# EasyEDA Pro project PCBPhase.eprj

# Schematic PCBPhase
Create Date: 2024-09-20; Page Name: P1; Project Name: PCBPhase; Schematic Name: PCBPhase; Update Date: 2024-09-19; Company: EasyEDA.com; Drawn: EasyEDA; Page Size: A4; Part Number: JLCPCB-002; Reviewed: EasyEDA; Version: V0.1
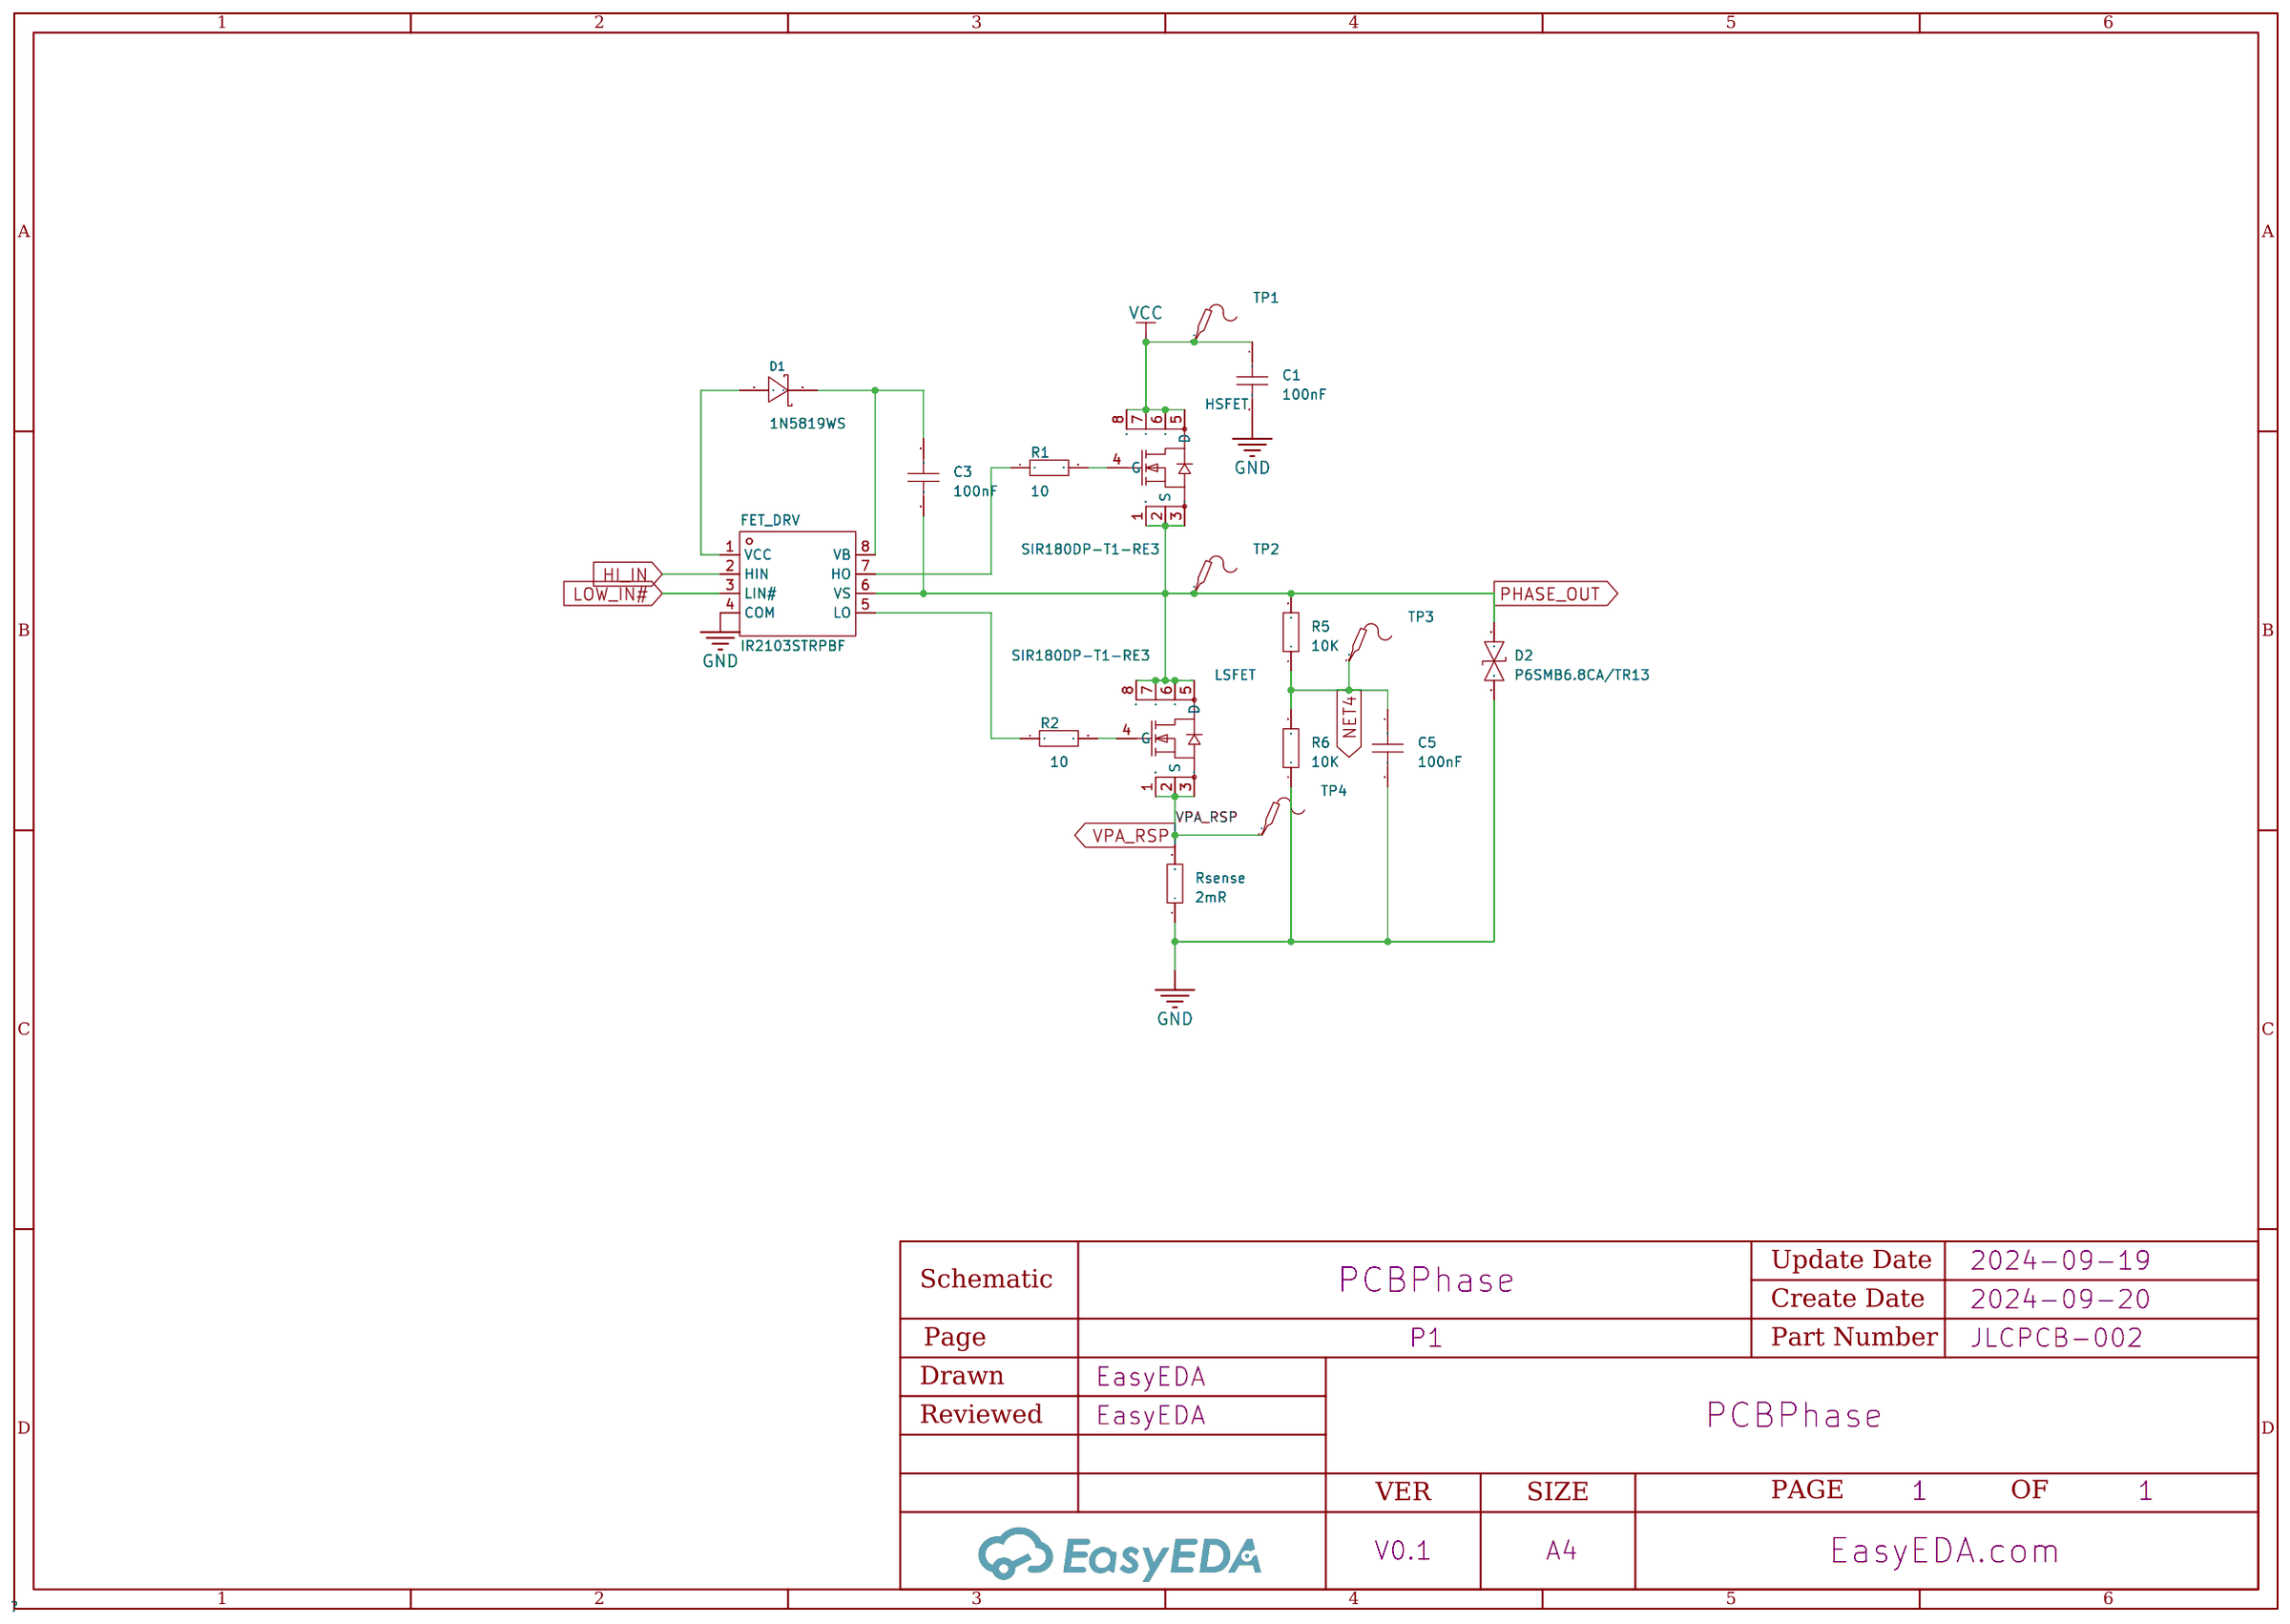
[diagram p0: schematic sheet]

## Parts
C1  100nF  [C0603]
C3  100nF  [C0603]
C5  100nF  [C0603]
D1  1N5819WS  [SOD-323_L1.8-W1.3-LS2.5-RD]
D2  P6SMB6.8CA/TR13  [SMB_L4.6-W3.6-LS5.3-BI]
FET_DRV  IR2103STRPBF  [SOIC-8_L4.9-W3.9-P1.27-LS6.0-BL]
HSFET  SIR180DP-T1-RE3  [POWERPAK-SO-8_L5.9-W4.9-P1.27-LS6.2-BL]
LSFET  SIR180DP-T1-RE3  [POWERPAK-SO-8_L5.9-W4.9-P1.27-LS6.2-BL]
R1  10  [R0603]
R2  10  [R0603]
R5  10K  [R0603]
R6  10K  [R0603]
Rsense  2mR  [R0603]
TP1  -  [Test-Point-0.5mm]
TP2  -  [Test-Point-0.5mm]
TP3  -  [Test-Point-0.5mm]
TP4  -  [Test-Point-0.5mm]

## Library data of the parts
C1 C3 C5 = CAP_0603: Supplier Footprint: 0603
D1 = 1N5819WS_C191023: Forward Voltage (Vf@If):600mV@1A Reverse Voltage (Vr):40V Average Rectified Current (Io):1A; LCSC Part Name: 电压:40V 电流:1A; Supplier Part: C191023; Manufacturer: Hottech(合科泰); Supplier Footprint: SOD-323; JLCPCB Part Class: Basic Part; Datasheet: https://atta.szlcsc.com/upload/public/pdf/source/20220428/3CB86FD8D28D653594B4E35F9D5AEFD9.pdf; Supplier: LCSC; Forward Voltage (Vf@If): 600mV@1A; Reverse Voltage (Vr): 40V; Average Rectified Current (Io): 1A
D2 = P6SMB6.8CA/TR13: Reverse Stand-Off Voltage (Vrwm):5.8V Maximum Clamping Voltage:10.5V Peak Pulse Current (Ipp)@10/1000us:58.1A Peak Pulse Power Dissipation (Ppp)@10/1000us:600W Breakdown Voltage:6.45V Type:TVS; Supplier Part: C78395; Manufacturer: Brightking(君耀电子); Supplier Footprint: SMB(DO-214AA); JLCPCB Part Class: Basic Part; Datasheet: https://atta.szlcsc.com/upload/public/pdf/source/20160709/1468031879762.pdf; Supplier: LCSC; Reverse Stand-Off Voltage (Vrwm): 5.8V; Maximum Clamping Voltage: 10.5V; Peak Pulse Current (Ipp)@10/1000us: 58.1A; Peak Pulse Power Dissipation (Ppp)@10/1000us: 600W; Breakdown Voltage: 6.45V; Type: TVS
FET_DRV = IR2103STRPBF: Driven Configuration:Half Bridge Load Type:MOSFET；IGBT Number of Drivers:2 Peak Output Current(sink):360mA Peak Output Current(source):210mA Supply Voltage:10V~20V Supply Voltage:10V~20V Rise Time:100ns Fall Time:50ns Operating Temperature:-40℃~+150℃@(Tj); Supplier Part: C2957; Manufacturer: Infineon(英飞凌); Supplier Footprint: SOIC-8; JLCPCB Part Class: Extended Part; Datasheet: https://atta.szlcsc.com/upload/public/pdf/source/20140228/1457706997637.pdf; Supplier: LCSC; Driven Configuration: Half Bridge; Load Type: MOSFET；IGBT; Number of Drivers: 2; Peak Output Current(sink): 360mA; Peak Output Current(source): 210mA; Supply Voltage: 10V~20V; Rise Time: 100ns; Fall Time: 50ns; Operating Temperature: -40℃~+150℃@(Tj)
HSFET LSFET = SIR180DP-T1-RE3: Type:1个NChannel Drain Source Voltage (Vdss):60V Continuous Drain Current (Id):；32.4A Power Dissipation (Pd):； Drain Source On Resistance (RDS(on)@Vgs,Id):2.05mΩ@10A,10V Gate Threshold Voltage (Vgs(th)@Id):3.6V@250uA Total Gate Charge (Qg@Vgs):87nC@10V Inp; LCSC Part Name: 1个N沟道 耐压:60V 电流:60A 电流:32.4A; Supplier Part: C5334421; Manufacturer: VISHAY(威世); Supplier Footprint: SO-8; JLCPCB Part Class: Extended Part; Datasheet: https://atta.szlcsc.com/upload/public/pdf/source/20221230/5EAF42ED79532020A551540FC13481A3.pdf; Supplier: LCSC; Type: 1个NChannel; Drain Source Voltage (Vdss): 60V; Continuous Drain Current (Id): ；32.4A; Power Dissipation (Pd): ；; Drain Source On Resistance (RDS(on)@Vgs,Id): 2.05mΩ@10A,10V; Gate Threshold Voltage (Vgs(th)@Id): 3.6V@250uA; Total Gate Charge (Qg@Vgs): 87nC@10V; Input Capacitance (Ciss@Vds): 4.03nF@30V; Operating Temperature: -55℃~+150℃@(Tj)
R1 R2 R5 R6 Rsense = Res_0603: Supplier Footprint: 0603
TP1-TP4 = Test-Point: Test Point 测试点

## Nets
GND: C1.2 C5.2 D2.1 FET_DRV.4(COM) R6.1 Rsense.1
VCC: C1.1 HSFET.5(D) HSFET.6(D) HSFET.7(D) HSFET.8(D) TP1.1
HI_IN: FET_DRV.2(HIN)
LOW_IN#: FET_DRV.3(LIN#)
NET4: C5.1 R5.1 R6.2 TP3.1
PHASE_OUT: C3.2 D2.2 FET_DRV.6(VS) HSFET.1(S) HSFET.2(S) HSFET.3(S) LSFET.5(D) LSFET.6(D) LSFET.7(D) LSFET.8(D) R5.2 TP2.1
VPA_RSP: LSFET.1(S) LSFET.2(S) LSFET.3(S) Rsense.2 TP4.1
$1N508: FET_DRV.7(HO) R1.1
$1N509: HSFET.4(G) R1.2
$1N510: FET_DRV.5(LO) R2.1
$1N511: LSFET.4(G) R2.2
$1N519: D1.2(A) FET_DRV.1(VCC)
$1N521: C3.1 D1.1(K) FET_DRV.8(VB)

# Schematic Schematic1
Create Date: 2024-09-20; Page Name: P1; Project Name: PCBPhase; Schematic Name: Schematic1; Update Date: 2024-09-20; Company: EasyEDA.com; Drawn: EasyEDA; Page Size: A4; Part Number: JLCPCB-002; Reviewed: EasyEDA; Version: V0.1
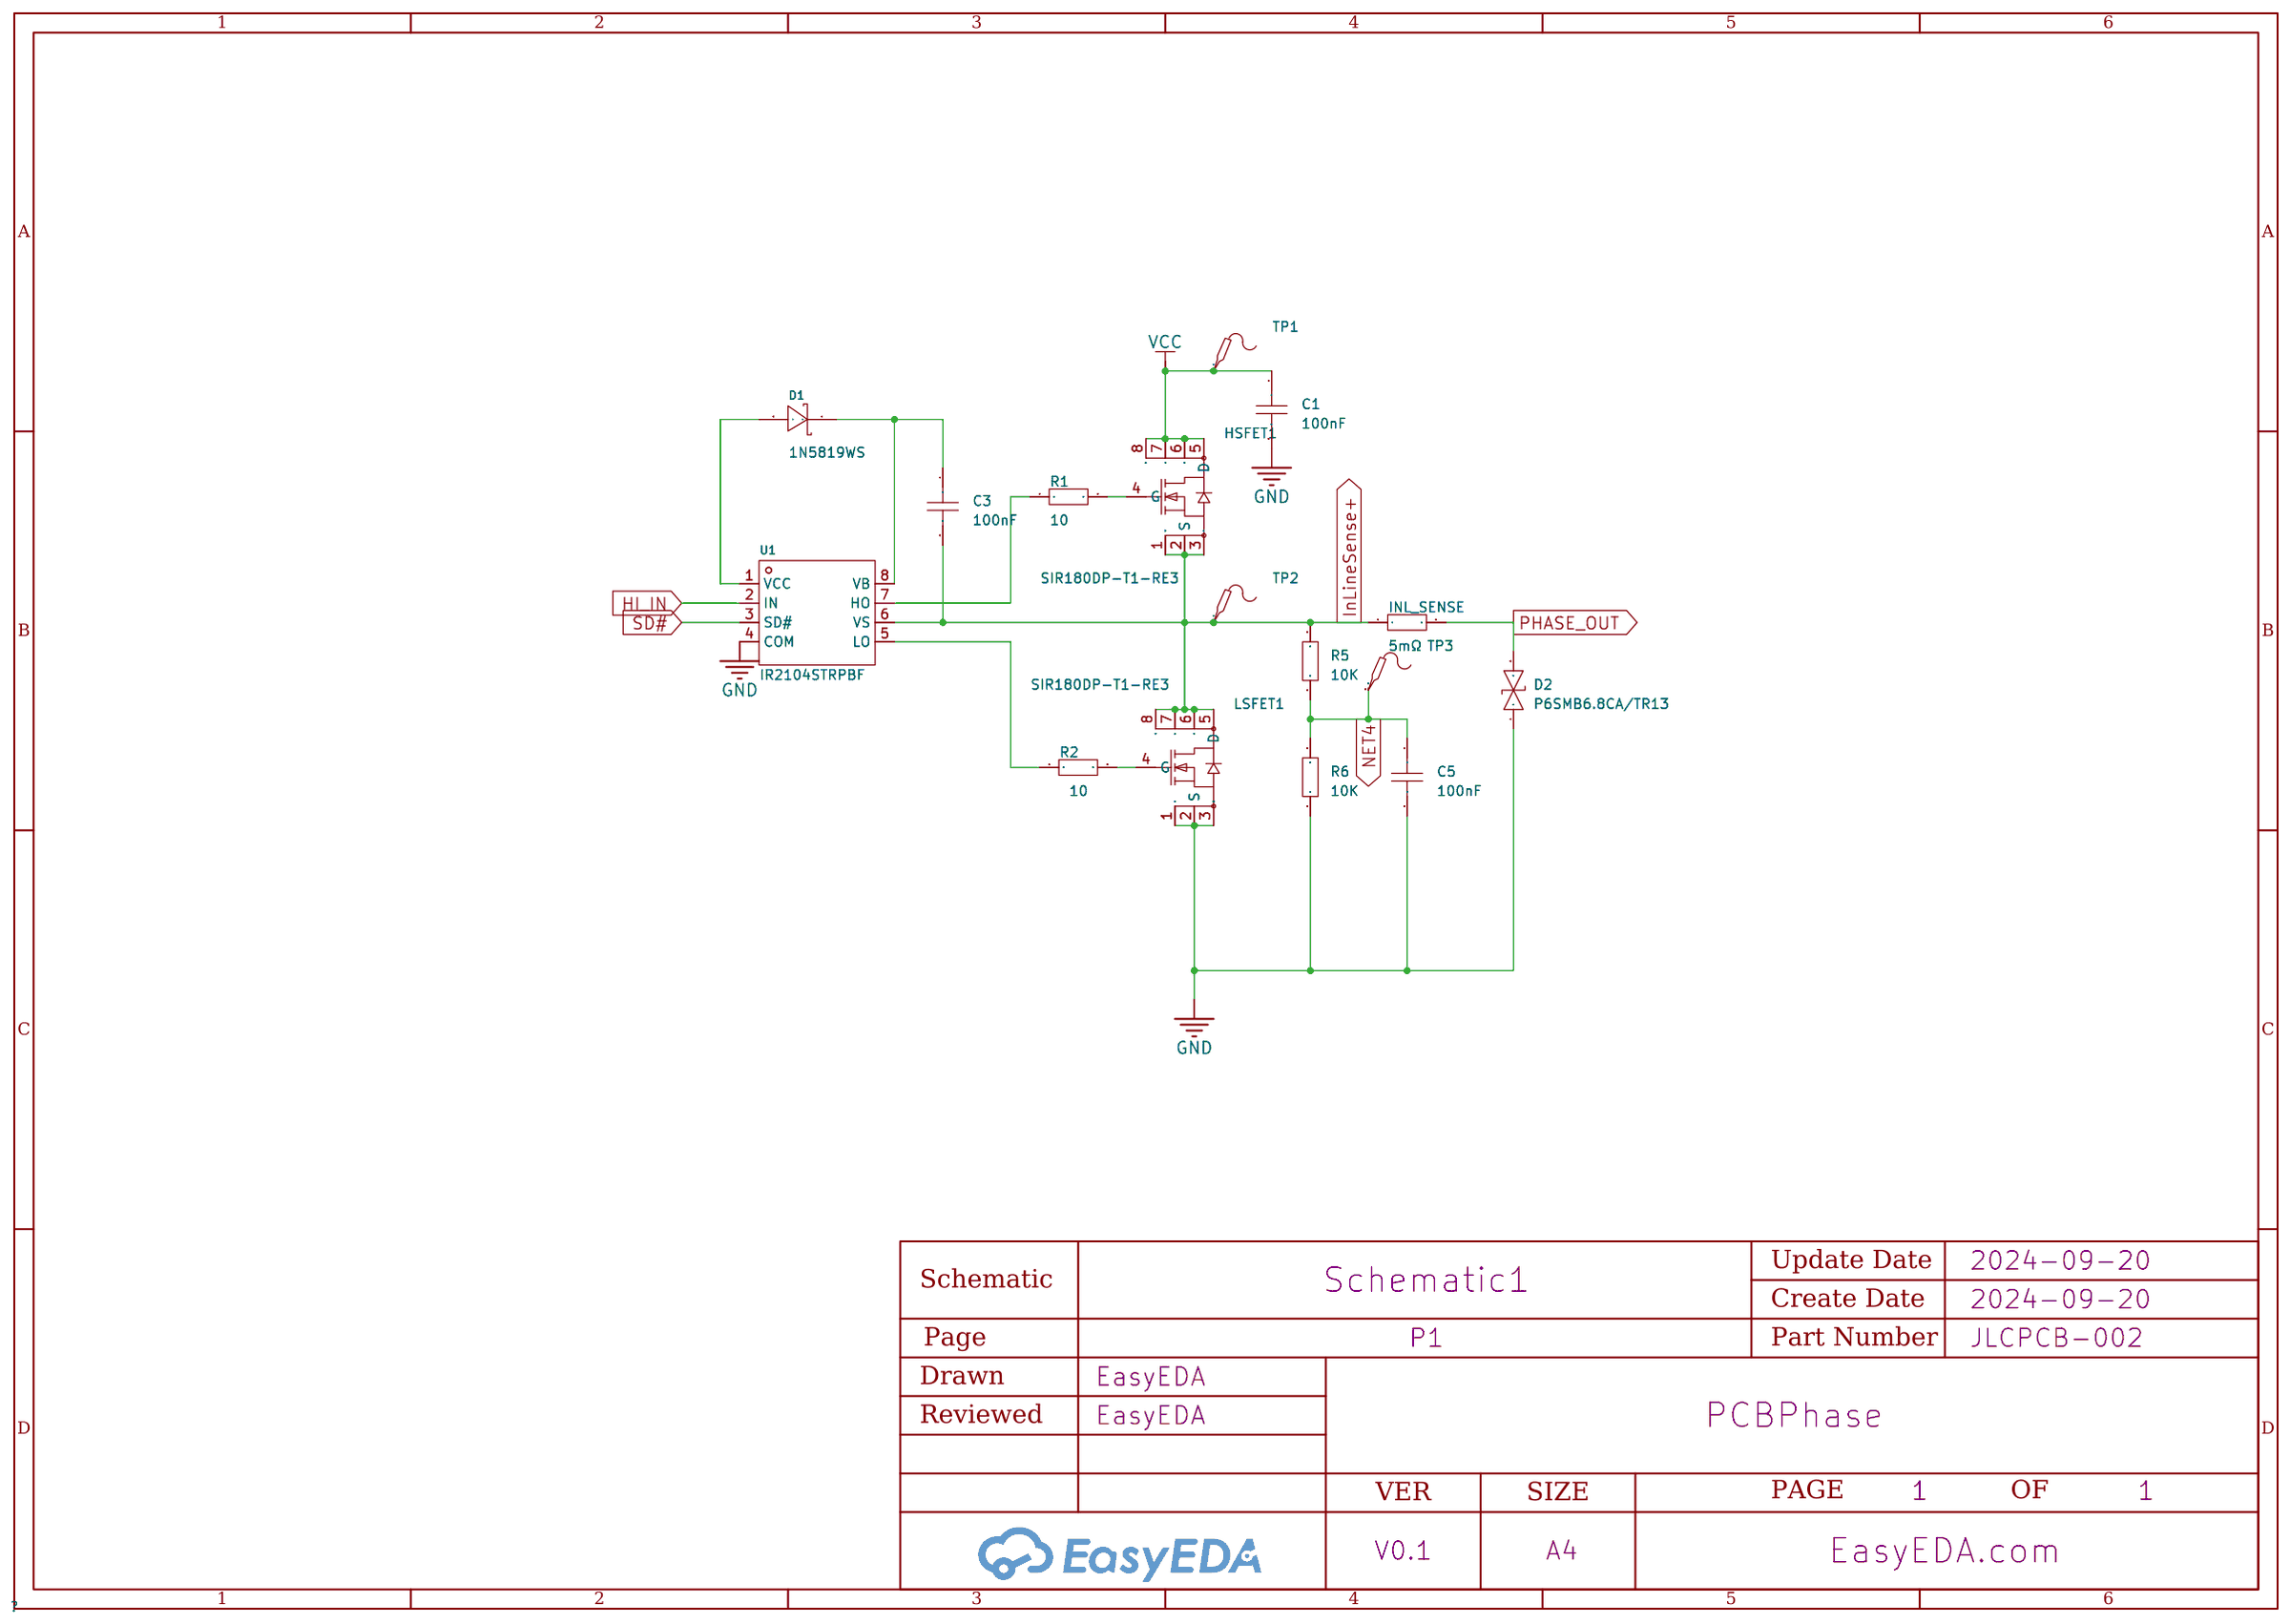
[diagram p1: schematic sheet]

## Parts
C1  100nF  [C0603]
C3  100nF  [C0603]
C5  100nF  [C0603]
D1  1N5819WS  [SOD-323_L1.8-W1.3-LS2.5-RD]
D2  P6SMB6.8CA/TR13  [SMB_L4.6-W3.6-LS5.3-BI]
HSFET1  SIR180DP-T1-RE3  [POWERPAK-SO-8_L5.9-W4.9-P1.27-LS6.2-BL]
INL_SENSE  5mΩ  [R2512]
LSFET1  SIR180DP-T1-RE3  [POWERPAK-SO-8_L5.9-W4.9-P1.27-LS6.2-BL]
R1  10  [R0603]
R2  10  [R0603]
R5  10K  [R0603]
R6  10K  [R0603]
TP1  -  [Test-Point-0.5mm]
TP2  -  [Test-Point-0.5mm]
TP3  -  [Test-Point-0.5mm]
U1  IR2104STRPBF  [SOIC-8_L4.9-W3.9-P1.27-LS6.0-BL]

## Library data of the parts
C1 C3 C5 = CAP_0603: Supplier Footprint: 0603
D1 = 1N5819WS_C191023: Forward Voltage (Vf@If):600mV@1A Reverse Voltage (Vr):40V Average Rectified Current (Io):1A; LCSC Part Name: 电压:40V 电流:1A; Supplier Part: C191023; Manufacturer: Hottech(合科泰); Supplier Footprint: SOD-323; JLCPCB Part Class: Basic Part; Datasheet: https://atta.szlcsc.com/upload/public/pdf/source/20220428/3CB86FD8D28D653594B4E35F9D5AEFD9.pdf; Supplier: LCSC; Forward Voltage (Vf@If): 600mV@1A; Reverse Voltage (Vr): 40V; Average Rectified Current (Io): 1A
D2 = P6SMB6.8CA/TR13: Reverse Stand-Off Voltage (Vrwm):5.8V Maximum Clamping Voltage:10.5V Peak Pulse Current (Ipp)@10/1000us:58.1A Peak Pulse Power Dissipation (Ppp)@10/1000us:600W Breakdown Voltage:6.45V Type:TVS; Supplier Part: C78395; Manufacturer: Brightking(君耀电子); Supplier Footprint: SMB(DO-214AA); JLCPCB Part Class: Basic Part; Datasheet: https://atta.szlcsc.com/upload/public/pdf/source/20160709/1468031879762.pdf; Supplier: LCSC; Reverse Stand-Off Voltage (Vrwm): 5.8V; Maximum Clamping Voltage: 10.5V; Peak Pulse Current (Ipp)@10/1000us: 58.1A; Peak Pulse Power Dissipation (Ppp)@10/1000us: 600W; Breakdown Voltage: 6.45V; Type: TVS
HSFET1 LSFET1 = SIR180DP-T1-RE3: Type:1个NChannel Drain Source Voltage (Vdss):60V Continuous Drain Current (Id):；32.4A Power Dissipation (Pd):； Drain Source On Resistance (RDS(on)@Vgs,Id):2.05mΩ@10A,10V Gate Threshold Voltage (Vgs(th)@Id):3.6V@250uA Total Gate Charge (Qg@Vgs):87nC@10V Inp; LCSC Part Name: 1个N沟道 耐压:60V 电流:60A 电流:32.4A; Supplier Part: C5334421; Manufacturer: VISHAY(威世); Supplier Footprint: SO-8; JLCPCB Part Class: Extended Part; Datasheet: https://atta.szlcsc.com/upload/public/pdf/source/20221230/5EAF42ED79532020A551540FC13481A3.pdf; Supplier: LCSC; Type: 1个NChannel; Drain Source Voltage (Vdss): 60V; Continuous Drain Current (Id): ；32.4A; Power Dissipation (Pd): ；; Drain Source On Resistance (RDS(on)@Vgs,Id): 2.05mΩ@10A,10V; Gate Threshold Voltage (Vgs(th)@Id): 3.6V@250uA; Total Gate Charge (Qg@Vgs): 87nC@10V; Input Capacitance (Ciss@Vds): 4.03nF@30V; Operating Temperature: -55℃~+150℃@(Tj)
INL_SENSE = PA2512FKF7W0R005E: Type:Current Sensing Resistors Resistance: Tolerance:±1% Tolerance:±1% Power(Watts): Temperature Coefficient:±100ppm/℃ Temperature Coefficient:±100ppm/℃; LCSC Part Name: 5mΩ ±1% 2W; Supplier Part: C309526; Manufacturer: YAGEO(国巨); Supplier Footprint: 2512; JLCPCB Part Class: Extended Part; Datasheet: https://atta.szlcsc.com/upload/public/pdf/source/20190227/C375693_219964CC8B3EBD36DBDF701587FA5938.pdf; Supplier: LCSC; Type: Current Sensing Resistors; Tolerance: ±1%; Temperature Coefficient: ±100ppm/℃
R1 R2 R5 R6 = Res_0603: Supplier Footprint: 0603
TP1-TP3 = Test-Point: Test Point 测试点
U1 = IR2104STRPBF: Driven Configuration:Half Bridge Load Type:MOSFET；IGBT Number of Drivers:2 Peak Output Current(sink):360mA Peak Output Current(source):210mA Supply Voltage:10V~20V Supply Voltage:10V~20V Rise Time:100ns Fall Time:50ns Operating Temperature:-40℃~+150℃@(Tj); Supplier Part: C2960; Manufacturer: Infineon(英飞凌); Supplier Footprint: SOIC-8; JLCPCB Part Class: Extended Part; Datasheet: https://atta.szlcsc.com/upload/public/pdf/source/20140906/1457707236579.pdf; Supplier: LCSC; Driven Configuration: Half Bridge; Load Type: MOSFET；IGBT; Number of Drivers: 2; Peak Output Current(sink): 360mA; Peak Output Current(source): 210mA; Supply Voltage: 10V~20V; Rise Time: 100ns; Fall Time: 50ns; Operating Temperature: -40℃~+150℃@(Tj)

## Nets
GND: C1.2 C5.2 D2.1 LSFET1.1(S) LSFET1.2(S) LSFET1.3(S) R6.1 U1.4(COM)
VCC: C1.1 HSFET1.5(D) HSFET1.6(D) HSFET1.7(D) HSFET1.8(D) TP1.1
HI_IN: U1.2(IN)
InLineSense+: C3.2 HSFET1.1(S) HSFET1.2(S) HSFET1.3(S) INL_SENSE.1 LSFET1.5(D) LSFET1.6(D) LSFET1.7(D) LSFET1.8(D) R5.2 TP2.1 U1.6(VS)
NET4: C5.1 R5.1 R6.2 TP3.1
PHASE_OUT: D2.2 INL_SENSE.2
SD#: U1.3(SD#)
$1N624: R1.1 U1.7(HO)
$1N625: HSFET1.4(G) R1.2
$1N626: R2.1 U1.5(LO)
$1N627: LSFET1.4(G) R2.2
$1N633: D1.2(A) U1.1(VCC)
$1N635: C3.1 D1.1(K) U1.8(VB)

# Board PCB2
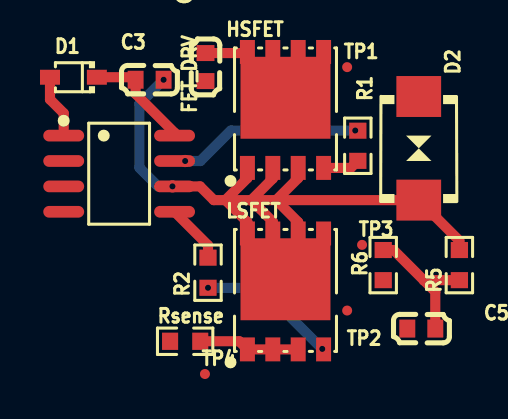
[diagram p2: board, top side]
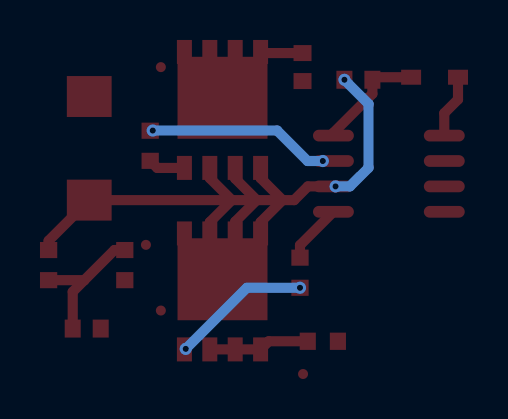
[diagram p3: board, bottom side, seen from below]

No outline. copper layers: Top Layer, Bottom Layer. Coordinates in mm from the lowest, leftmost part position.
Stack: Top Layer 0.035mm / Dielectric1 1.51mm FR4 er 4.5 / Bottom Layer 0.035mm

## Design rules (mm)
template: JLCPCB Capability(Two Layers Board)
spacing copperThickness1oz (default): track to track 0.102, other pairs 0.152 to 0.3
spacing copperThickness2oz: track to track 0.203, other pairs 0.152 to 0.3
track width copperThickness1oz (default): min 0.127, default 0.254, max 2.54
track width copperThickness2oz: min 0.203, default 0.254, max 2.54
differential pair differentialPair (default): width min 0.127, default 0.254, max 2.54; gap min 0.152, default 0.152
via viaSize (default): diameter min 0.5, default 0.61, max 10; hole min 0.3, default 0.305, max 6.3

## Placement (name value [footprint] x y rotation side)
C1  100nF  [C0603]  6.6 15.35 270 top
C3  100nF  [C0603]  3.81 14.72 0 top
C5  100nF  [C0603]  17.4 2.27 180 top
D1  1N5819WS  [SOD-323_L1.8-W1.3-LS2.5-RD]  0 14.85 180 top
D2  P6SMB6.8CA/TR13  [SMB_L4.6-W3.6-LS5.3-BI]  17.27 11.29 270 top
FET_DRV  IR2103STRPBF  [SOIC-8_L4.9-W3.9-P1.27-LS6.0-BL]  2.29 10.02 270 top
HSFET  SIR180DP-T1-RE3  [POWERPAK-SO-8_L5.9-W4.9-P1.27-LS6.2-BL]  10.61 13.21 0 top
LSFET  SIR180DP-T1-RE3  [powerpak-so-8_l5.9-w4.9-p1.27-ls6.2-bl]  10.61 4.13 0 top
R1  10  [R0603]  14.22 11.42 270 top
R2  10  [R0603]  6.73 5.07 270 top
R5  10K  [R0603]  19.3 5.45 90 top
R6  10K  [R0603]  15.49 5.45 90 top
Rsense  2mR  [R0603]  5.59 1.64 0 top
TP1  -  [Test-Point-0.5mm]  13.69 15.35 0 top
TP2  -  [Test-Point-0.5mm]  13.69 3.18 0 top
TP3  -  [Test-Point-0.5mm]  14.44 6.46 0 top
TP4  -  [Test-Point-0.5mm]  6.58 0 0 top

## Footprints (pads in the part's own frame, mm; a bottom-side part is the same pattern mirrored in y, then rotated)
C0603
  rect 0.8x0.9 smd: 1(-0.7,0) 2(0.7,0)
POWERPAK-SO-8_L5.9-W4.9-P1.27-LS6.2-BL
  rect 0.75x1.2 smd: 1(-1.905,-2.9) 2(-0.635,-2.9) 3(0.635,-2.9) 4(1.905,-2.9) 5(1.905,2.9) 6(0.635,2.9) 7(-0.635,2.9) 8(-1.905,2.9)
  rect 4.5x4.1 smd: 8(0,0.609)
powerpak-so-8_l5.9-w4.9-p1.27-ls6.2-bl
  rect 0.75x1.2 smd: 1(-1.905,-2.9) 2(-0.635,-2.9) 3(0.635,-2.9) 4(1.905,-2.9) 5(1.905,2.9) 6(0.635,2.9) 7(-0.635,2.9) 8(-1.905,2.9)
  rect 4.5x4.1 smd: 8(0,0.609)
R0603
  rect 0.806x0.864 smd: 1(-0.753,0) 2(0.753,0)
SMB_L4.6-W3.6-LS5.3-BI
  rect 2.047x2.241 smd: 1(-2.591,0) 2(2.591,0)
SOD-323_L1.8-W1.3-LS2.5-RD
  rect 1x0.75 smd: 1(-1.173,0) 2(1.173,0)
SOIC-8_L4.9-W3.9-P1.27-LS6.0-BL
  oval 0.588x2.045 smd: 1(-1.905,-2.772) 2(-0.635,-2.772) 3(0.635,-2.772) 4(1.905,-2.772) 5(1.905,2.772) 6(0.635,2.772) 7(-0.635,2.772) 8(-1.905,2.772)
Test-Point-0.5mm
  round 0.5 smd: 1(0,0)

## Nets
As in the schematic.

## Via types
v1: diameter 0.61, hole 0.305, Top Layer to Bottom Layer, 6 vias

## Routing (per net, layer and track width the routed paths; a pad name or vN(x,y) marks a point on that pad's centre or on a via; arc(x,y) is an arc through that point)
VCC: length 2.1
  Top Layer w0.508: C1.1 8.65,16.05 HSFET.8
NET4: length 7.1
  Top Layer w0.508: R6.2 16.01,6.2 17.53,4.69 ; 17.53,4.69 18.1,4.11 C5.1 ; 17.53,4.69 17.53,4.69 R5.1
PHASE_OUT: length 35.4
  Top Layer w0.508: R5.2 19.3,6.67 D2.2 10.14,8.7 ; v1(4.95,9.38) FET_DRV.6 6.34,9.38 7.02,8.7 7.6,8.7 ; 10.14,8.7 8.89,8.7 ; 10.14,8.7 11.24,7.6 LSFET.6 ; 10.14,8.7 11.24,9.8 HSFET.3 ; 8.89,8.7 9.97,9.78 HSFET.2 ; 8.89,8.7 9.97,7.62 LSFET.7 ; 8.89,8.7 7.6,8.7 ; 7.6,8.7 8.7,9.8 HSFET.1 ; 7.6,8.7 8.7,7.6 LSFET.8
  Bottom Layer w0.508: v1(4.51,14.72) 3.3,13.51 3.3,10.32 4.23,9.38 v1(4.95,9.38)
VPA_RSP: length 5.1
  Top Layer w0.508: Rsense.2 8.29,1.64 LSFET.1 LSFET.2 LSFET.3
$1N508: length 9.3
  Top Layer w0.254: v1(14.1,12.18) 14.22,12.18 R1.1
  Bottom Layer w0.508: v1(14.1,12.18) 7.87,12.18 6.35,10.66 v1(5.59,10.66)
$1N509: length 1.9
  Top Layer w0.508: HSFET.4 13.87,10.31 R1.2
$1N510: length 3
  Top Layer w0.508: FET_DRV.5 6.73,6.44 R2.1
$1N511: length 7.1
  Top Layer w0.508: LSFET.4 12.49,1.26 v1(12.45,1.26)
  Bottom Layer w0.508: v1(12.45,1.26) 9.39,4.31 v1(6.73,4.31)
$1N519: length 3.2
  Top Layer w0.508: D1.2 -1.17,13.73 -0.49,13.05 FET_DRV.1
$1N521: length 5.6
  Top Layer w0.508: D1.1 2.98,14.85 C3.1 3.11,14.01 5.06,12.07 FET_DRV.8

# Board PCB3
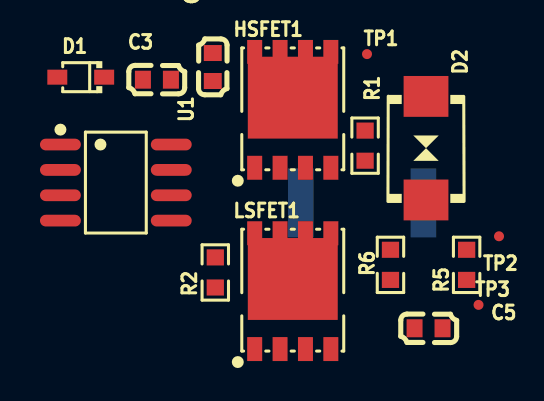
[diagram p4: board, top side]
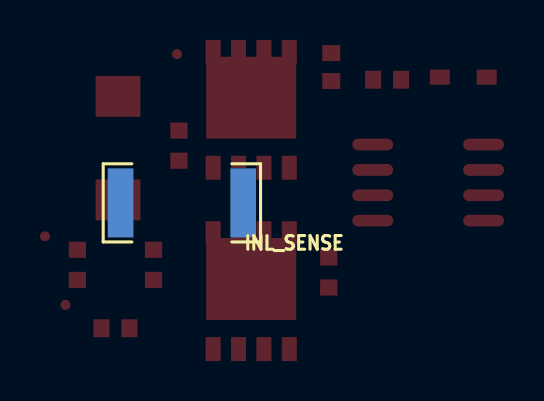
[diagram p5: board, bottom side, seen from below]

No outline. copper layers: Top Layer, Bottom Layer. Coordinates in mm from the lowest, leftmost part position.
Stack: Top Layer 0.035mm / Dielectric1 1.51mm FR4 er 4.5 / Bottom Layer 0.035mm

## Design rules (mm)
template: JLCPCB Capability(Two Layers Board)
spacing copperThickness1oz (default): track to track 0.102, other pairs 0.152 to 0.3
spacing copperThickness2oz: track to track 0.203, other pairs 0.152 to 0.3
track width copperThickness1oz (default): min 0.127, default 0.254, max 2.54
track width copperThickness2oz: min 0.203, default 0.254, max 2.54
differential pair differentialPair (default): width min 0.127, default 0.254, max 2.54; gap min 0.152, default 0.152
via viaSize (default): diameter min 0.5, default 0.61, max 10; hole min 0.3, default 0.305, max 6.3

## Placement (name value [footprint] x y rotation side)
C1  100nF  [C0603]  6.6 13.08 270 top
C3  100nF  [C0603]  3.81 12.45 0 top
C5  100nF  [C0603]  17.4 0 180 top
D1  1N5819WS  [SOD-323_L1.8-W1.3-LS2.5-RD]  0 12.57 180 top
D2  P6SMB6.8CA/TR13  [SMB_L4.6-W3.6-LS5.3-BI]  17.27 9.02 270 top
HSFET1  SIR180DP-T1-RE3  [POWERPAK-SO-8_L5.9-W4.9-P1.27-LS6.2-BL]  10.61 10.94 0 top
INL_SENSE  5mΩ  [R2512]  14.08 6.28 0 bottom
LSFET1  SIR180DP-T1-RE3  [POWERPAK-SO-8_L5.9-W4.9-P1.27-LS6.2-BL]  10.61 1.86 0 top
R1  10  [R0603]  14.22 9.14 270 top
R2  10  [R0603]  6.73 2.79 270 top
R5  10K  [R0603]  19.3 3.17 90 top
R6  10K  [R0603]  15.49 3.17 90 top
TP1  -  [Test-Point-0.5mm]  14.32 13.73 0 top
TP2  -  [Test-Point-0.5mm]  20.92 4.61 0 top
TP3  -  [Test-Point-0.5mm]  19.9 1.17 0 top
U1  IR2104STRPBF  [SOIC-8_L4.9-W3.9-P1.27-LS6.0-BL]  1.76 7.29 270 top

## Footprints (pads in the part's own frame, mm; a bottom-side part is the same pattern mirrored in y, then rotated)
C0603
  rect 0.8x0.9 smd: 1(-0.7,0) 2(0.7,0)
POWERPAK-SO-8_L5.9-W4.9-P1.27-LS6.2-BL
  rect 0.75x1.2 smd: 1(-1.905,-2.9) 2(-0.635,-2.9) 3(0.635,-2.9) 4(1.905,-2.9) 5(1.905,2.9) 6(0.635,2.9) 7(-0.635,2.9) 8(-1.905,2.9)
  rect 4.5x4.1 smd: 8(0,0.609)
R0603
  rect 0.806x0.864 smd: 1(-0.753,0) 2(0.753,0)
R2512
  rect 1.282x3.456 smd: 1(-3.067,0) 2(3.067,0)
SMB_L4.6-W3.6-LS5.3-BI
  rect 2.047x2.241 smd: 1(-2.591,0) 2(2.591,0)
SOD-323_L1.8-W1.3-LS2.5-RD
  rect 1x0.75 smd: 1(-1.173,0) 2(1.173,0)
SOIC-8_L4.9-W3.9-P1.27-LS6.0-BL
  oval 0.588x2.045 smd: 1(-1.905,-2.772) 2(-0.635,-2.772) 3(0.635,-2.772) 4(1.905,-2.772) 5(1.905,2.772) 6(0.635,2.772) 7(-0.635,2.772) 8(-1.905,2.772)
Test-Point-0.5mm
  round 0.5 smd: 1(0,0)

## Nets
As in the schematic, except:
$1N941: C3.2 HSFET1.1 HSFET1.2 HSFET1.3 INL_SENSE.1 LSFET1.5 LSFET1.6 LSFET1.7 LSFET1.8 R5.2 TP2.1 U1.6
